# Altium project HCPL-3120 DIP One Leg Gate Driver Circuit.PrjPcb
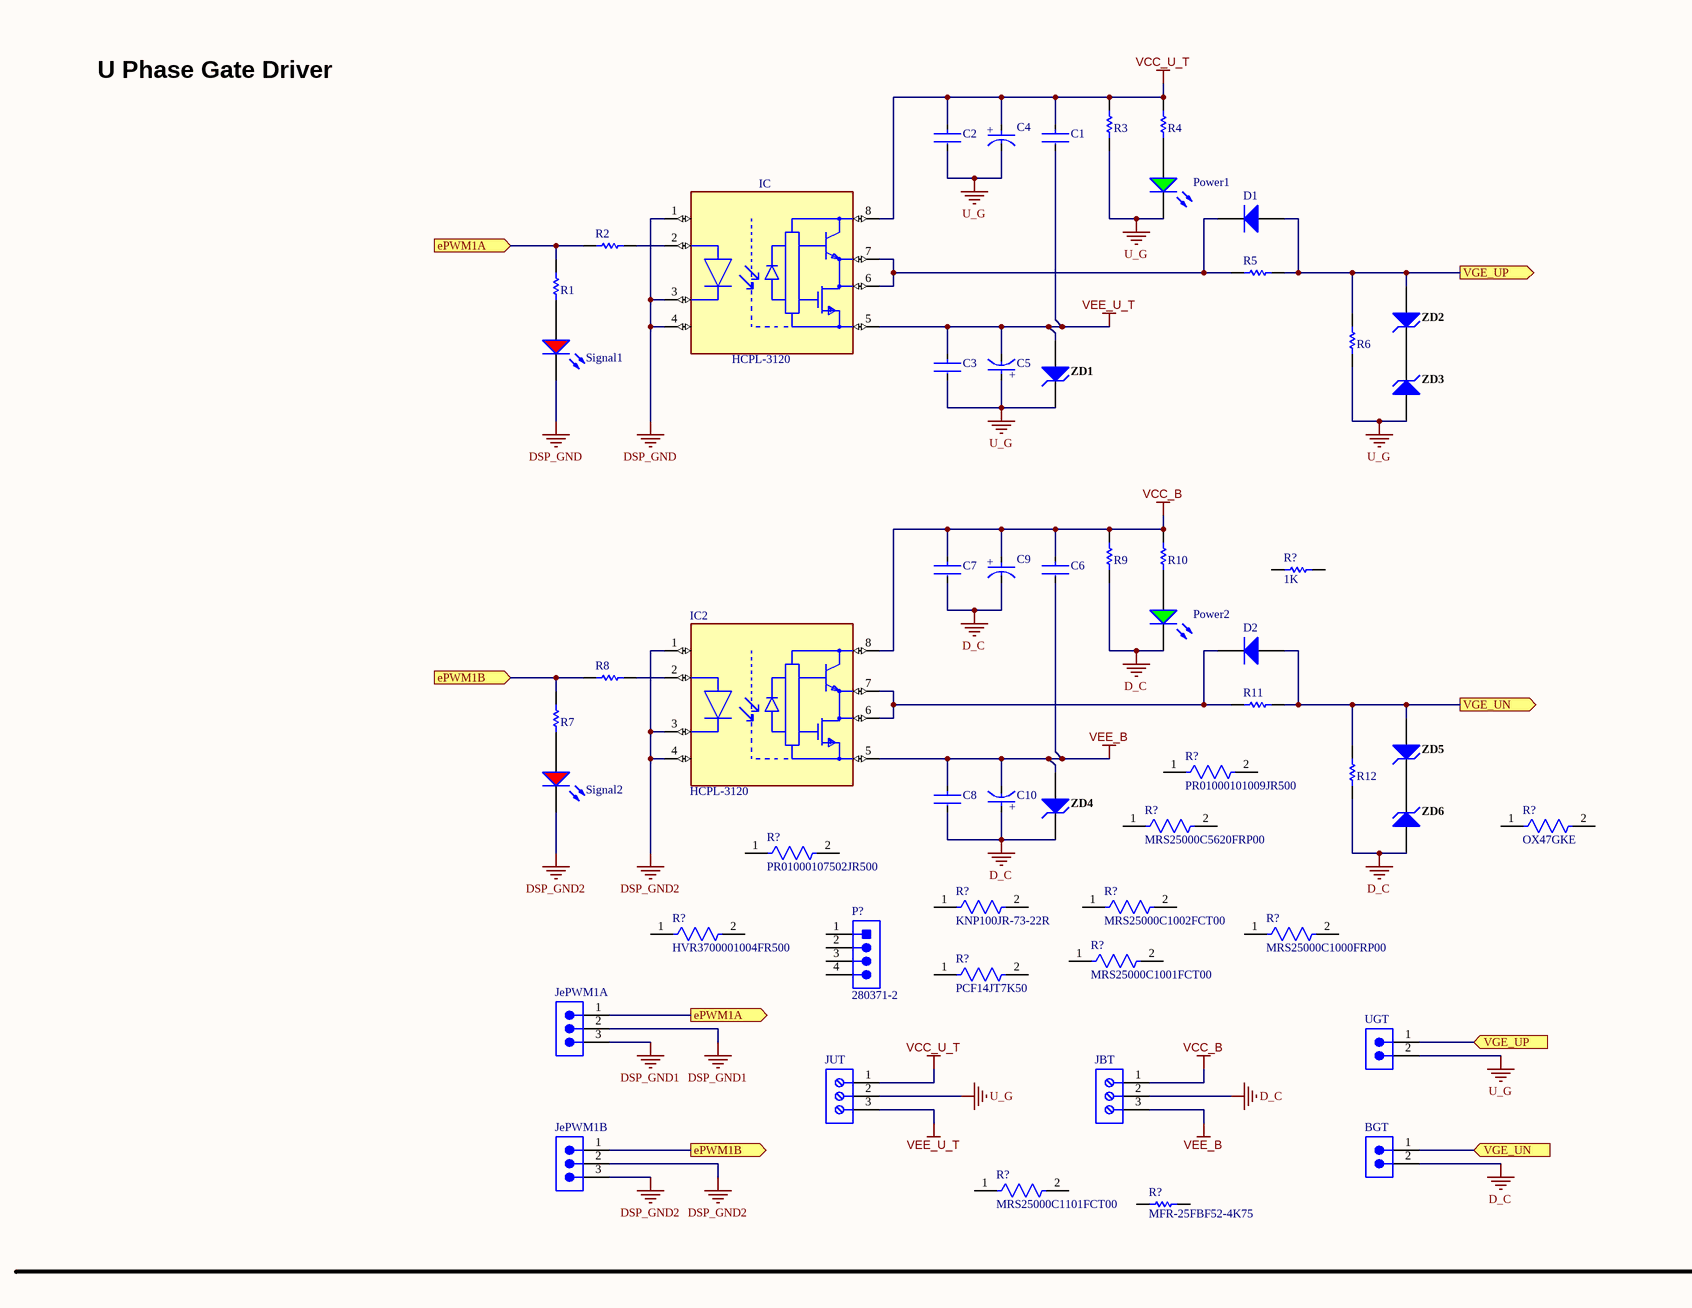
[diagram p0: HCPL-3120 DIP One Leg Gate Driver Circuit.SchDoc, left]
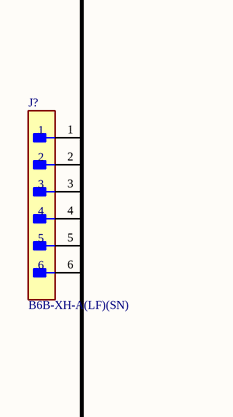
[diagram p1: HCPL-3120 DIP One Leg Gate Driver Circuit.SchDoc, middle]
1 sheet, 57 parts. Net scope: flat (ports and power ports of the same name join across sheets).
Board file: HCPL-3120 DIP One Leg Gate Driver Circuit.PcbDoc

## Sheet HCPL-3120 DIP One Leg Gate Driver Circuit.SchDoc
size A0; SheetNumber: 1; SheetTotal: 1

### Parts
(Parts that share a designator on the sheet are numbered #1, #2 ... from top to bottom, then left to right.)
BGT  61300211121  [61300211121]  (value not drawn)
C1  SR205C104KAR  [FP-SR20-MFG]  (value not drawn)
C2  SR205C104KAR  [FP-SR20-MFG]  (value not drawn)
C3  SR205C104KAR  [FP-SR20-MFG]  (value not drawn)
C4  EEUTA1H101  [FP-RAD-TH-D_10_0_5-L_12_5-MFG]  (value not drawn)
C5  EEUTA1H101  [FP-RAD-TH-D_10_0_5-L_12_5-MFG]  (value not drawn)
C6  SR205C104KAR  [FP-SR20-MFG]  (value not drawn)
C7  SR205C104KAR  [FP-SR20-MFG]  (value not drawn)
C8  SR205C104KAR  [FP-SR20-MFG]  (value not drawn)
C9  EEUTA1H101  [FP-RAD-TH-D_10_0_5-L_12_5-MFG]  (value not drawn)
C10  EEUTA1H101  [FP-RAD-TH-D_10_0_5-L_12_5-MFG]  (value not drawn)
D1  1N4007-B  [DIOD-DO-41-P-2_V]  (value not drawn)
D2  1N4007-B  [DIOD-DO-41-P-2_V]  (value not drawn)
IC  HCPL-3120  [PCBComponent_1]
IC2  HCPL-3120  [PCBComponent_1]
J?  B6B-XH-A(LF)(SN)  [FP-B6B-XH-A_LF_SN-MFG]
JBT  691214110003  [691214110003]  (value not drawn)
JePWM1A  61300311121  [61300311121]  (value not drawn)
JePWM1B  61300311121  [61300311121]  (value not drawn)
JUT  691214110003  [691214110003]  (value not drawn)
P?  280371-2  [TECO-280371-2_V]
Power1  151031VS04000  [WL-TMRC_D3.95H5.3]  (value not drawn)
Power2  151031VS04000  [WL-TMRC_D3.95H5.3]  (value not drawn)
R1  MFR-25FBF52-1K  [RESA60-630X240]  (value not drawn)
R2  MFR-25FBF52-221R  [RESA60-630X240]  (value not drawn)
R3  MFR-25FBF52-1K  [RESA60-630X240]  (value not drawn)
R4  MFR-25FBF52-1K  [RESA60-630X240]  (value not drawn)
R5  MFR-25FBF52-47R5  [RESA60-630X240]  (value not drawn)
R6  MFR-25FBF5210K  [RESA60-630X240]  (value not drawn)
R7  MFR-25FBF52-1K  [RESA60-630X240]  (value not drawn)
R8  MFR-25FBF52-221R  [RESA60-630X240]  (value not drawn)
R9  MFR-25FBF52-1K  [RESA60-630X240]  (value not drawn)
R10  MFR-25FBF52-1K  [RESA60-630X240]  (value not drawn)
R11  MFR-25FBF52-47R5  [RESA60-630X240]  (value not drawn)
R12  MFR-25FBF5210K  [RESA60-630X240]  (value not drawn)
R?#1  value 1K  (hidden comment: Resistor)
R?#2  PR01000101009JR500  [FP-PR01-MFG]
R?#3  MRS25000C5620FRP00  [FP-MRS25-MFG]
R?#4  OX47GKE  [FP-OX-MFG]
R?#5  PR01000107502JR500  [FP-PR01-MFG]
R?#6  KNP100JR-73-22R  [FP-KNP100-MFG]
R?#7  MRS25000C1002FCT00  [FP-MRS25-MFG]
R?#8  HVR3700001004FR500  [FP-HVR37-MFG]
R?#9  MRS25000C1000FRP00  [FP-MRS25-MFG]
R?#10  MRS25000C1001FCT00  [FP-MRS25-MFG]
R?#11  PCF14JT7K50  [FP-CF14-MFG]
R?#12  MRS25000C1101FCT00  [FP-MRS25-MFG]
R?#13  MFR-25FBF52-4K75  [RESA60-630X240]
Signal1  151031SS04000  [WL-TMRC_D3.95H5.3]  (value not drawn)
Signal2  151031SS04000  [WL-TMRC_D3.95H5.3]  (value not drawn)
UGT  61300211121  [61300211121]  (value not drawn)
ZD1  1N4749A  [FAIR-DO-41-2_V]  (value not drawn)
ZD2  1N4749A  [FAIR-DO-41-2_V]  (value not drawn)
ZD3  1N4749A  [FAIR-DO-41-2_V]  (value not drawn)
ZD4  1N4749A  [FAIR-DO-41-2_V]  (value not drawn)
ZD5  1N4749A  [FAIR-DO-41-2_V]  (value not drawn)
ZD6  1N4749A  [FAIR-DO-41-2_V]  (value not drawn)

### Ports
ePWM1A (in, see HCPL-3120 DIP One Leg Gate Driver Circuit[2A]), ePWM1A (out, see HCPL-3120 DIP One Leg Gate Driver Circuit[2A]), ePWM1B (in, see HCPL-3120 DIP One Leg Gate Driver Circuit[2B]), ePWM1B (out, see HCPL-3120 DIP One Leg Gate Driver Circuit[2A]), VGE_UN (in, see HCPL-3120 DIP One Leg Gate Driver Circuit[4A]), VGE_UN (out, see HCPL-3120 DIP One Leg Gate Driver Circuit[5B]), VGE_UP (in, see HCPL-3120 DIP One Leg Gate Driver Circuit[4A]), VGE_UP (out, see HCPL-3120 DIP One Leg Gate Driver Circuit[5A])

### Nets
D_C: BGT.2 C7.2 C8.2 C9.1(C) C10.2(A) JBT.2 Power2.2(K) R9.2 R12.2 ZD4.2(K) ZD6.1(A)
DSP_GND: IC.1(NC) IC.3(K) IC.4(NC) Signal1.2(K)
DSP_GND1: JePWM1A.2 JePWM1A.3
DSP_GND2: IC2.1(NC) IC2.3(K) IC2.4(NC) JePWM1B.2 JePWM1B.3 Signal2.2(K)
U_G: C2.2 C3.2 C4.1(C) C5.2(A) JUT.2 Power1.2(K) R3.2 R6.2 UGT.2 ZD1.2(K) ZD3.1(A)
VCC_B: C6.1 C7.1 C9.2(A) IC2.8(VCC) JBT.1 R9.1 R10.1
VCC_U_T: C1.1 C2.1 C4.2(A) IC.8(VCC) JUT.1 R3.1 R4.1
VEE_B: C6.2 C8.1 C10.1(C) IC2.5(VEE) JBT.3 ZD4.1(A)
VEE_U_T: C1.2 C3.1 C5.1(C) IC.5(VEE) JUT.3 ZD1.1(A)
NetBGT_1: BGT.1 D2.1(A) R11.2 R12.1 ZD5.1(A) ; port VGE_UN
NetD1_1: D1.1(A) R5.2 R6.1 UGT.1 ZD2.1(A) ; port VGE_UP
NetD1_2: D1.2(K) IC.6(VO) IC.7(VO) R5.1
NetD2_2: D2.2(K) IC2.6(VO) IC2.7(VO) R11.1
NetIC2_2: IC2.2(A) R8.2
NetIC_2: IC.2(A) R2.2
NetJePWM1A_1: JePWM1A.1 R1.1 R2.1 ; port ePWM1A
NetJePWM1B_1: JePWM1B.1 R7.1 R8.1 ; port ePWM1B
NetPower1_1: Power1.1(A) R4.2
NetPower2_1: Power2.1(A) R10.2
NetR1_2: R1.2 Signal1.1(A)
NetR7_2: R7.2 Signal2.1(A)
NetZD2_2: ZD2.2(K) ZD3.2(K)
NetZD5_2: ZD5.2(K) ZD6.2(K)

Not connected (* = marked no-connect by the designer): J? 1 2 3 4 5 6; P? 1 2 3 4; R?#1 1 2; R?#2 1 2; R?#3 1 2; R?#4 1 2; R?#5 1 2; R?#6 1 2; R?#7 1 2; R?#8 1 2; R?#9 1 2; R?#10 1 2; R?#11 1 2; R?#12 1 2; R?#13 1 2

### Notes on the sheet
- U Phase Gate Driver
- (in symbol CMP-05427-000114-1) +

### Library data of the parts
BGT UGT = CMP-1712-00002-5: NexarPartId: 20081794; Operating Supply Voltage: 250V; Current Rating: 3A; Gender: Male; Number of Contacts: 2; Pitch: 2.54mm; Connector Type: Male Pin; Contact Resistance: 20mΩ; Contact Plating: Gold; Contact Material: Copper; Number of Pins: 2; Min Operating Temperature: -40°C; Packaging: Bulk; Lead Pitch: 2.54mm; Mount: Through Hole; Orientation: Vertical; RoHS: Compliant; REACH SVHC: No SVHC; Height: 8.94mm; Termination: Through Hole; Number of Positions: 2; Contact Mating Length: 5.9944mm; Color: Black; Contact Gender: Male; Number of Rows: 1; Housing Material: PBT; Lead Free: Lead Free; Voltage Rating: 250V; Max Operating Temperature: 125°C
C1-C3 C6-C8 = CMP-04427-000013-1: CAP CER 0.1UF 50V X7R RADIAL; Manufacturer: AVX; Material: Ceramic; Tolerance: 10%; Capacitance: 100nF; Value: 100nF; Voltage: 50V; Height: 5.08mm; Digikey Description: CAP CER 0.1UF 50V X7R RADIAL; Device Class L2: Capacitors; ComponentLink2URL: http://datasheets.avx.com/SR-Series.pdf; Temperature Range High: +125°C; Lead Free: Yes; Manufacturer Part Number: SR205C104KAR; Category: Cap; Device Class L1: Passive Components; Temperature: -55°C to +125°C; Voltage Rating: 50V; ComponentLink2Description: Datasheet; RoHS: TRUE; Automotive: No; Octopart: https://octopart.com/sr205c104kar-avx-145048; Mouser Description: Multilayer Ceramic Capacitors MLCC - Leaded 50volts 0.1uF 10% X7R; Temperature Characteristic: X7R; Device Class L3: Ceramic Capacitors; Temperature Range Low: -55°C; Package: SR20
C4 C5 C9 C10 = CMP-05427-000114-1: Aluminum Electrolytic Capacitors (Radial Lead Type) AEC-Q200 Qualified 100uF ±20% 50V; ESR (Equivalent Series Resistance): 180mR; Lead Diameter: 0.6mm; Life (Hours): 2000Hour; Ripple Current: 555mA; Series: TA; Package Quantity: 200; Length: 12.5mm; Lead Pitch: 5mm; REACH SVHC: No SVHC; RoHS Compliant: Yes; Height: 12.5mm; Contact Plating: Tin; Capacitance: 100uF; Height - Seated (Max): 0.531inch; Min Operating Temperature: -40°C; Voltage Rating (DC): 50V; Voltage Rating: 50V; Case/Package: Radial; Radiation Hardening: No; Tolerance: 20%; Impedance: 180mR; Diameter: 10mm; Packaging: Bulk; Max Operating Temperature: 125°C; Termination: Radial; Mount: Through Hole
D1 D2 = CMP-0639-00010-2: 30V, 1A Rectifier, 8 pF, -65 to 150 degC, 2-Pin DO-41 Plastic, RoHS, Bulk; Manufacturer: Diodes Inc; CT (pF): 8; VRRM (V): 1000; Max. Average Rectified Current IO (A): 1; Max. IR (uA): 5; Max. IFSM (A): 30; Packing: Bulk; Mounting Technology: Through Hole; PackageDescription: 2-Pin Axial Lead, Body 4.635 x 2.36 mm, Lead Spread 25.4 mm; Operating Temperature Range (degC): -65 to 150; ComponentLink1Description: Manufacturer URL; DatasheetVersion: Rev. 8-2; ComponentLink1URL: http://diodes.com/; ComponentLink2Description: Datasheet; PartNumber: 1N4007-B; ComponentLink2URL: http://diodes.com/datasheets/ds28002.pdf; RoHS: TRUE; PackageReference: DO-41-P-2; VF (V): 1
IC IC2 = CMP-18400-000012-1: OPTOISO 3.75KV 1CH GATE DVR 8DIP
J? = CMP-17439-000076-1: CONN HEADER VERT 6POS 2.5MM
JBT JUT = CMP-1502-02466-2: NexarPartId: 18818289; Number of Levels: 1; Voltage: 300V; Pitch: 3.5052mm; Stripping Length: -6mm; Number of Positions Per Level: 3; Plating: Brass, Steel; Wire/Cable Gauge: 24AWG; Wire Gauge (Min): 16AWG; Current Rating: 10A; Width: 10.9mm; Length: 7.4mm; Housing Material: Nylon; Height: 12.2mm; Min Operating Temperature: -40°C; Contact Plating: Brass, Tin; Packaging: Box; Color: Blue, Green; Number of Contacts: 3; Number of Pins: 3; Voltage Rating: 300V; Termination: Screw; Lead Pitch: 3.5mm; Max Operating Temperature: 105°C; Mount: Through Hole; Contact Material: Brass; RoHS: Compliant; Wire Gauge (Max): 24AWG; Current: 10A; REACH SVHC: Unknown
JePWM1A JePWM1B = CMP-1502-01062-2: NexarPartId: 32855521; Voltage Rating: 250V; Current Rating: 3A; Connector Type: Male Pin; Number of Positions: 3; Gender: Male; Contact Resistance: 20mΩ; Pitch: 2.54mm; Max Operating Temperature: 105°C; Lead Pitch: 2.54mm; Lead Free: Lead Free; Contact Mating Length: 5.9944mm; Contact Material: Copper; Number of Pins: 3; Orientation: Vertical; Height: 8.94mm; Packaging: Bulk; Min Operating Temperature: -40°C; Mount: Through Hole; RoHS: Compliant; Number of Contacts: 3; Operating Supply Voltage: 250V; Termination: Solder; Number of Rows: 1; Contact Plating: Gold; Color: Black; REACH SVHC: Unknown
P? = CMP-2000-05548-1: Male Header, Pitch 2.54 mm, 1 x 4 Position, Height 12.8 mm, Tail Length 3.5 mm, -55 to 105 degC, RoHS, Bulk; Manufacturer: TE Connectivity; Pitch: 0.100"(2.54mm); Connector Type: Header,Shrouded; Other Names: 280371-2-ND / A106401; Number of Positions Loaded: All; Dynamic Catalog: AMPMODUModIISeries; Number of Positions: 4; 3D Model: 280371-2.pdf; Termination: Solder; Package Description: Male Header, Pitch 2.54 mm, 1 x 4 Position, Height 12.8 mm, Tail Length 3.5 mm; Datasheet Version: Rev. M1, 08/2016; Contact Mating Length: 0.260"(6.60mm); Datasheet URL: http://www.te.com/commerce/DocumentDelivery/DDEController?Action=showdoc&DocId=Customer+Drawing%7F280370%7FM1%7Fpdf%7FEnglish%7FENG_CD_280370_M1.pdf%7F280371-2; Mounting Technology: ThroughHole; Standard Package: 1,000; Contact Finish Thickness: 15µin(0.38µm); Contact Finish: Gold; Contact Type: MalePin; Packaging: Bulk; Mounting Type: ThroughHole; Number of Rows: 1; Family: RectangularConnectors-Headers,MalePins; Manufacturer URL: http://www.te.com/; Color: Black; RoHS Information: 280371-2StatementofCompliance; Package Reference: 280371-2; Category: Connectors,Interconnects; Series: AMPMODUModII
Power1 Power2 = CMP-1488-00001-2: Led, Green, T-1 (3Mm), 570 Nm, 2.1 V, 30 Ma, 120 Mcd; NexarPartId: 29717804; Test Current: 20mA; Peak Wavelength: 573nm; Max Reverse Voltage (DC): 5V; Forward Voltage: 2.1V; Forward Current: 100mA; Dominant Wavelength: 570nm; Lens Style: Circular, Diffused, Round; Viewing Angle: 40°; Luminous Intensity: 120mcd; REACH SVHC: Unknown; Lens Size: 3mm; Mount: Through Hole; Width: 3mm; Color: Green; Case/Package: Radial; Packaging: Bulk; Height: 5.3mm; Wavelength: 570nm; RoHS: Compliant; Max Operating Temperature: 85°C; Length: 3mm; Number of Pins: 2; Min Operating Temperature: -40°C
R1 R3 R4 R7 R9 R10 = CMP-1659-00075-1: Axial Resistor, 1K Ohm, +/- 1%, 0.25W, -55 to 155 degC, 2-Pin THD, RoHS, Bulk; Voltage Rating: 250 V; Resistance: 10 kohm; Power Rating: 250 mW; ComponentLink2Description: Datasheet; RoHSCompliant: true; PackageReference: MFR-25; Case\Package: Axial; Max Operating Temperature: 155 degC; DatasheetVersion: Apr-13; Tolerance: 1%; ComponentLink1URL: http://www.yageo.com/; Length: 0.248 inch; ComponentLink2URL: http://www.yageo.com/documents/recent/Yageo%20LR_MFR_2013.pdf; Packaging: Bulk; Package Quantity: 200; PackageDescription: 2-Pin Axial Lead, Dia 2.4 mm, Body Length 6.3 mm; Min Operating Temperature: -55 degC; ComponentLink1Description: Manufacturer URL
R2 R8 = CMP-1659-00072-1: Axial Resistor, 330 Ohm, +/- 1%, 0.25W, -55 to 155 degC, 2-Pin THD, RoHS, Bulk; Max Supply Voltage: 3.6 V; Min Supply Voltage: 1.95 V; Interface: I2C; Case\Package: QFN; Nominal Supply Voltage: 2.5 V; Bandwidth: 800 Hz; Max Operating Temperature: 85 degC; Height: 0.95 mm; Mount: Surface Mount; Packaging: Tape and Reel; PackageReference: MFR-25; ComponentLink1Description: Manufacturer URL; Length: 3 mm; Min Operating Temperature: -40 degC; RoHSCompliant: true; ComponentLink2Description: Datasheet; Package Quantity: 1000; Pins: 16; ComponentLink2URL: http://www.yageo.com/documents/recent/Yageo%20LR_MFR_2013.pdf; Radiation Hardening: No; ComponentLink1URL: http://www.yageo.com/; Weight: 0.001122 oz; REACH SVHC: No SVHC; DatasheetVersion: Apr-13; PackageDescription: 2-Pin Axial Lead, Dia 2.4 mm, Body Length 6.3 mm
R5 R11 = CMP-1659-00067-1: Axial Resistor, 30 Ohm, +/- 1%, 0.25 W, -55 to 155 degC, 2-Pin THD, RoHS, Bulk; Nominal Voltage Gain: 100 dB; Slew Rate: 1 V\us; Common Mode Rejection Ratio: 50 dB; Bandwidth: 1 MHz; Min Supply Voltage: 3 V; Case\Package: SOIC; Output Current: 160 mA; Channels: 4; Max Supply Voltage: 5 V; Nominal Supply Current: 170 uA; Packaging: Tape and Reel; Pins: 14; ComponentLink1URL: http://www.yageo.com/; RoHSCompliant: true; Radiation Hardening: No; Width: 3.91 mm; ComponentLink2Description: Datasheet; PackageReference: MFR-25; Length: 8.65 mm; ComponentLink1Description: Manufacturer URL; Mount: Surface Mount; Nominal Gain Bandwith Product: 1 MHz; DatasheetVersion: Apr-13; Unity Gain Bandwidth Product: 1 MHz; Min Operating Temperature: -40 degC; Max Operating Temperature: 85 degC; PackageDescription: 2-Pin Axial Lead, Dia 2.4 mm, Body Length 6.3 mm; ComponentLink2URL: http://www.yageo.com/documents/recent/Yageo%20LR_MFR_2013.pdf; Package Quantity: 2500; Height: 1.58 mm; REACH SVHC: No SVHC
R6 R12 = CMP-1659-00074-2: Axial Resistor, 10K Ohm, +/- 1%, 0.25 W, -55 to 155 degC, 2-Pin THD, RoHS, Bulk; Manufacturer: Yageo; Temperature Coefficient: 100ppm\/degreesC; Voltage Rating: 250V; Voltage Rating (DC): 200V; Resistance: 10KOhm; Max Power Dissipation: 250mW; Datasheet URL: http://www.yageo.com/documents/recent/Yageo%20LR_MFR_2013.pdf; Packaging: Bulk; RoHSCompliant: True; Mount: ThroughHole; Package Reference: MFR-25; Termination: Axial; Composition: MetalFilm; Number of Terminations: 2; Package Quantity: 200; Mounting Technology: ThroughHole; Length: 0.248inch; Max Operating Temperature: 155degC; Min Operating Temperature: -55degC; Datasheet Version: 04/2013; Lead Free: LeadFree; Manufacturer URL: http://www.yageo.com/; Tolerance: 1%; Power Rating: 250mW; Package Description: 2-Pin Axial Lead, Dia 2.4 mm, Body Length 6.3 mm; Military Standard: Not; Case\/Package: Axial
R?#1 = Resistor: TC1: 0; SimulationGenericComponent: True; TC2: 0
R?#2 = CMP-00030-42467166-1: PR01000101009JR500 Fixed Resistor, Metal Film, 1W, 10ohm, 350V, 5% +/-Tol, 250ppm/Cel, Through Hole Mount; Lead Diameter: 580µm; Resistance: 10Ω; Wire/Cable Diameter: 50µm; Temperature Coefficient: 250ppm/°C; Length: 8mm; Lead Free: Lead Free; Number of Pins: 2; Contact Plating: Tin; Packaging: Tape & Reel (TR); Diameter: 2.5mm; Termination: Axial; Max Operating Temperature: 155°C; Power Rating: 1W; Voltage Rating: 350V; Features: Automotive AEC-Q200, Flame Retardant Coating; Composition: Metal Film; Min Operating Temperature: -55°C; Max Power Dissipation: 1W; Number of Terminations: 2; RoHS: Compliant; NexarPartId: 42467166; Mount: Through Hole; Width: 2.5mm; Schedule B: 8533210090, 8533210090; Height: 2.5mm; Tolerance: 5%; Operating Supply Voltage: 350V; Voltage Rating (DC): 350V; Radiation Hardening: No; Weight: 211.997734mg; Case/Package: Axial; REACH SVHC: Unknown
R?#3 = CMP-02408-000052-1: RES 562 OHM 0.6W 1% AXIAL; Lead Diameter: 0.6mm; Max Power Dissipation: 600mW; Voltage Rating: 350V; Resistance: 562R; Temperature Coefficient: 50ppm/°C; RoHS Compliant: Yes; Number of Terminations: 2; Termination: Axial; Series: MRS25; Length: 6.5mm; Mount: Through Hole; Packaging: Tape and Reel; Resistor Type: Thin Film; Radiation Hardening: No; Max Operating Temperature: 155°C; Min Operating Temperature: -55°C; Tolerance: 1%; Contact Plating: Tin; Case/Package: Axial; Package Quantity: 1; Width: 2.5mm; Lead Free: Lead Free; Power Rating: 600mW; Technology: METAL FILM; Diameter: 2.5mm
R?#4 = CMP-00273-00060511-1: OX47GKE OX FIXED RESISTOR Axial Through Hole Resistor ±10% -1000/ -1600ppm/C 4.7Ohm 1W; NexarPartId: 60511; Voltage Rating: 300V; Lead Length: 38mm; Resistance: 4.7Ω; Temperature Coefficient: 300ppm/°C; Wire/Cable Diameter: 787.4µm; Lead Diameter: 800µm; Number of Terminations: 2; Min Operating Temperature: -40°C; Mount: Through Hole; Tolerance: 10%; Voltage Rating (DC): 300V; Power Rating: 1W; Length: 16.51mm; Diameter: 5.5mm; Features: Moisture Resistant; Max Power Dissipation: 1W; Termination: Axial; Max Operating Temperature: 220°C; Lead Free: Lead Free; Number of Pins: 2; Height: 6.5mm; RoHS: Compliant; REACH SVHC: Unknown; Packaging: Bulk; Composition: Ceramic; Case/Package: Axial; Material: Ceramic
R?#5 = CMP-02408-000029-1: RES 75K OHM 1W 5% AXIAL; Lead Diameter: 0.58mm; Voltage Rating: 350V; Resistance: 75kR; Temperature Coefficient: 250ppm/°C; Max Power Dissipation: 1W; Resistance Tolerance: 5%; RoHS Compliant: Yes; Power Rating: 1W; Packaging: Tape and Reel; Package Quantity: 5000; Width: 2.5mm; Number of Pins: 2; Operating Supply Voltage: 350V; Resistor Type: Metal Film; Technology: METAL FILM; Max Operating Temperature: 155°C; Termination: Axial; Lead Free: Lead Free; Voltage Rating (DC): 350V; Series: PR01; Diameter: 2.5mm; Min Operating Temperature: -55°C; Case/Package: Axial; Number of Terminations: 2; Features: Flame Retardant Coating; Length: 0.256inch; Tolerance: 5%
R?#6 = CMP-03413-000004-1: RES 22 OHM 1W 5% AXIAL; Manufacturer: Yageo; Value: 22Ω; Temperature Coefficient: 300ppm/°C; Mouser Description: Wirewound Resistors 22ohm 1W 5%; ComponentLink2Description: Datasheet; Temperature: -40°C to +200°C; Series: KNP; Package: KNP100; Category: Res; ComponentLink2URL: https://www.yageo.com/upload/media/product/products/datasheet/lr/Yageo_LR_KNP_1.pdf; Automotive: No; RoHS: TRUE; Composition: Wirewound; Resistance: 22Ω; Device Class L1: Passive Components; Ipc Land Pattern Name: RESAD1811W100L1250D510; Digikey Description: RES 22 OHM 1W 5% AXIAL; Device Class L2: Resistors; Octopart: https://octopart.com/knp100jr-73-22r-yageo-19031610; Height: 5.1mm; Temperature Range High: +200°C; Temperature Range Low: -40°C; Manufacturer Part Number: KNP100JR-73-22R; Tolerance: 5%; Lead Free: Yes; Power Rating: 1W; Device Class L3: Through-Hole Resistors
R?#7 = CMP-00030-42632392-1: MRS25000C1002FCT00 Resistor, 10 kOhm, ± 1%, 600 mW, Axial Leaded, Metal Film (Thin Film), Professional; Power Rating: 600mW; Voltage Rating (DC): 350V; Lead Length: 26mm; Resistance: 10kΩ; Temperature Coefficient: 50ppm/°C; Termination: Axial; Number of Terminations: 2; Diameter: 2.5mm; Composition: Metal Film, Thin Film; Number of Pins: 2; Length: 6.5mm; Military Standard: Not; RoHS: Compliant; NexarPartId: 42632392; Width: 2.5mm; Radiation Hardening: No; Voltage Rating: 350V; Max Power Dissipation: 600mW; Min Operating Temperature: -55°C; Lead Free: Lead Free; Max Operating Temperature: 155°C; Tolerance: 1%; Schedule B: 8533210090, 8533210090; Contact Plating: Tin; Mount: Through Hole; REACH SVHC: Unknown; Case/Package: Conformal
R?#8 = CMP-00030-42845042-1: HVR3700001004FR500 Fixed Resistor, Metal Film, 0.5W, 1000000ohm, 3500V, 1% +/-Tol, 200ppm/Cel, Through Hole Mount; Resistance: 1MΩ; Voltage Rating: 3.5kV; Max Power Dissipation: 500mW; Lead Diameter: 780µm; Temperature Coefficient: 200ppm/°C; Number of Pins: 2; Composition: Metal Film; Features: Flame Retardant Coating; Schedule B: 8533210090, 8533210090; RoHS: Compliant; Voltage Rating (DC): 3.5kV; Min Operating Temperature: -55°C; REACH SVHC: Unknown; Tolerance: 1%; Termination: Axial; Radiation Hardening: No; Height: 4mm; Packaging: Cut Tape (CT); Length: 10.0076mm; Number of Terminations: 2; Max Operating Temperature: 155°C; Power Rating: 500mW; NexarPartId: 42845042; Lead Free: Lead Free; Case/Package: Axial
R?#9 = CMP-00030-42757237-1: MRS25000C1000FRP00 Resistor, 100 Ohm, ± 1%, 600 mW, Axial Leaded, Metal Film (Thin Film), Professional; Max Power Dissipation: 600mW; Resistance: 100Ω; Voltage Rating: 350V; Temperature Coefficient: 50ppm/°C; Lead Diameter: 600µm; RoHS: Compliant; Radiation Hardening: No; Schedule B: 8533210090, 8533210090; Length: 6.5mm; Packaging: Tape & Reel (TR); Number of Terminations: 2; Mount: Through Hole; Width: 2.5mm; Tolerance: 1%; Military Standard: Not; Voltage Rating (DC): 350V; Contact Plating: Tin; Number of Pins: 2; Max Operating Temperature: 155°C; NexarPartId: 42757237; Diameter: 2.5mm; Composition: Metal Film, Thin Film; REACH SVHC: Unknown; Power Rating: 600mW; Lead Free: Lead Free; Termination: Axial; Case/Package: Axial; Min Operating Temperature: -55°C
R?#10 = CMP-02408-000051-1: RES 1K OHM 0.6W 1% AXIAL; Power Rating: 600mW; Lead Diameter: 0.6mm; Voltage Rating (DC): 350V; Resistance: 1kR; Temperature Coefficient: 50ppm/°C; Width: 2.5mm; Military Standard: Not; Package Quantity: 5000; Radiation Hardening: No; Case/Package: Axial; Resistance Tolerance: 1%; Resistor Type: Metal Film; Contact Plating: Tin; Length: 6.5mm; Lead Free: Lead Free; RoHS Compliant: Yes; Mount: Through Hole; Number of Pins: 2; Technology: THIN FILM; Voltage Rating: 350V; Min Operating Temperature: -55°C; Weight: 0.00776oz; Diameter: 2.5mm; Construction: Cylindrical; Series: MRS25; Tolerance: 1%; Packaging: Tape and Reel; Max Operating Temperature: 155°C; Max Power Dissipation: 600mW; Number of Terminations: 2; Termination: Axial
R?#11 = CMP-26528-000003-1: RES 7.5K OHM 1/4W 5% AXIAL; Max Power Dissipation: 250mW; Temperature Coefficient: -400ppm/°C; Resistance: 7.5kR; RoHS Compliant: Yes; Lead Free: Lead Free; Max Operating Temperature: 155°C; Case/Package: Axial; Tolerance: 5%; Power Rating: 250mW; Diameter: 2.3mm; Features: Flame Retardant Coating; Series: CF; Resistor Type: Carbon Film; Number of Terminations: 2; Length: 0.256inch; Min Operating Temperature: -55°C; Contact Plating: Tin; Packaging: Tape and Reel; Mount: Through Hole; Radiation Hardening: No
R?#12 = CMP-02408-000003-1: RES 1.1K OHM 0.6W 1% AXIAL; Manufacturer: Vishay BC Components; Voltage Rating: 350V; Resistance: 1.1kΩ; Temperature Coefficient: 50ppm/°C; Value: 1.1kΩ; Device Class L1: Passive Components; Height: 2.5mm; Octopart: https://octopart.com/mrs25000c1101fct00-vishay-43740214; Temperature Range Low: -55°C; Temperature: -55°C to +155°C; Temperature Range High: +155°C; Lead Free: Yes; Mouser Description: Thin Film Resistors .6watt 1.1Kohms 1%; Power Rating: 0.6W; Digikey Description: RES 1.1K OHM 0.6W 1% AXIAL; RoHS: TRUE; Tolerance: 1%; Package: MRS25; Device Class L3: Through-Hole Resistors; ComponentLink2URL: http://www.vishay.com/docs/28724/mrs16m25.pdf; ComponentLink2Description: Datasheet; Composition: Thin Film; Automotive: No; Ipc Land Pattern Name: RESAD1000W75L650D250; Device Class L2: Resistors; Category: Res; Series: MRS25; Manufacturer Part Number: MRS25000C1101FCT00
R?#13 = CMP-1659-00066-1: Axial Resistor, 4.75 KOhm, +/- 1%, 0.25 W, -55 to 155 degC, 2-Pin THD, RoHS, Bulk; Case\Package: 1210; Voltage Rating (DC): 25 V; Type (Capacitors): X7R; Capacitance: 22 uF; Tolerance: 10%; PackageReference: MFR-25; DatasheetVersion: Apr-13; PackageDescription: 2-Pin Axial Lead, Dia 2.4 mm, Body Length 6.3 mm; ComponentLink1URL: http://www.yageo.com/; Radiation Hardening: No; Mount: Surface Mount; Height: 2.5 mm; Pins: 2; Package Quantity: 1000; REACH SVHC: No SVHC; Case Code (Imperial): 1210; Packaging: Tape and Reel; Max Operating Temperature: 125 degC; Case Code (Metric): 3225; ComponentLink1Description: Manufacturer URL; Min Operating Temperature: -55 degC; ComponentLink2Description: Datasheet; Voltage Rating: 25 V; Length: 3.2 mm; ComponentLink2URL: http://www.yageo.com/documents/recent/Yageo%20LR_MFR_2013.pdf; RoHSCompliant: true; Width: 2.5 mm
Signal1 Signal2 = CMP-1488-00005-2: Led, Red, T-1 (3Mm), 635 Nm, 2 V, 30 Ma, 160 Mcd; NexarPartId: 29717802; Wavelength: 635nm; Luminous Intensity: 160mcd; Peak Wavelength: 640nm; Forward Voltage: 2V; Max Reverse Voltage (DC): 5V; Viewing Angle: 40°; Forward Current: 100mA; Lens Style: Circular, Diffused, Round; Test Current: 20mA; Packaging: Bulk; Lens Size: 3mm; RoHS: Compliant; Height: 5.3mm; Mount: Through Hole; Max Operating Temperature: 85°C; Color: Red; Length: 3mm; Dominant Wavelength: 635nm; REACH SVHC: Unknown; Case/Package: Radial; Min Operating Temperature: -40°C; Width: 3mm
ZD1 ZD4 = CMP-0892-00026-1: Zener Diode, 4.7V, 500mW, 5%, -65 to 200 degC, 2-Pin DO-41, Body 2.72 x 5.2 mm, RoHS; Manufacturer: Fairchild Semiconductor; VZ (Max.) (V): 25.2; IR (uA): 5; PD (W): 1; Test Current IZ (mA): 10.5; VZ (Min.) (V): 22.8; ZZ (Max) (ohm): 25; RoHS: TRUE; ComponentLink2Description: Datasheet; ComponentLink3Description: Package Specification; PackageDescription: 2-Pin Axial leaded, Body 2.72 x 5.2 mm, Lead Spread 25.4 mm; Tolerance: 5%; PartNumber: 1N4749A; Operating and Storage Temperature Range: -65 to 200 degC; PackageReference: DO-41-2; PackageVersion: Rev. 2; Mounting Technology: Through Hole; DatasheetVersion: Rev. H3; ComponentLink3URL: http://www.fairchildsemi.com/dwg/DO/DO41A.pdf; ComponentLink1URL: http://www.fairchildsemi.com/; ComponentLink1Description: Manufacturer URL; ComponentLink2URL: http://www.fairchildsemi.com/ds/1N/1N4744A.pdf
ZD2 ZD3 ZD5 ZD6 = CMP-0892-00026-1: Zener Diode, 15V, 500mW, 5%, -65 to 200 degC, 2-Pin DO-41, Body 2.72 x 5.2 mm, RoHS; Manufacturer: Fairchild Semiconductor; VZ (Max.) (V): 25.2; IR (uA): 5; PD (W): 1; Test Current IZ (mA): 10.5; VZ (Min.) (V): 22.8; ZZ (Max) (ohm): 25; RoHS: TRUE; ComponentLink2Description: Datasheet; ComponentLink3Description: Package Specification; PackageDescription: 2-Pin Axial leaded, Body 2.72 x 5.2 mm, Lead Spread 25.4 mm; Tolerance: 5%; PartNumber: 1N4749A; Operating and Storage Temperature Range: -65 to 200 degC; PackageReference: DO-41-2; PackageVersion: Rev. 2; Mounting Technology: Through Hole; DatasheetVersion: Rev. H3; ComponentLink3URL: http://www.fairchildsemi.com/dwg/DO/DO41A.pdf; ComponentLink1URL: http://www.fairchildsemi.com/; ComponentLink1Description: Manufacturer URL; ComponentLink2URL: http://www.fairchildsemi.com/ds/1N/1N4744A.pdf